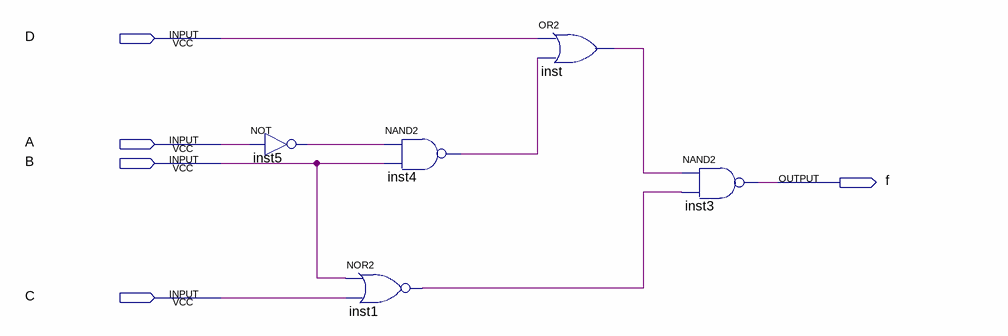
[diagram p0: schematic sheet]
// Quartus schematic Lab2.bdf as structural Verilog: 5 symbols, 5 pins
module Lab2 (
  input  D,
  input  A,
  input  B,
  input  C,
  output f
);

  wire inst1_out, inst4_out, inst5_out, inst_out;

  not inst5 (inst5_out, A);
  nor inst1 (inst1_out, B, C);
  nand inst4 (inst4_out, inst5_out, B);
  or inst (inst_out, D, inst4_out);
  nand inst3 (f, inst_out, inst1_out);
endmodule
